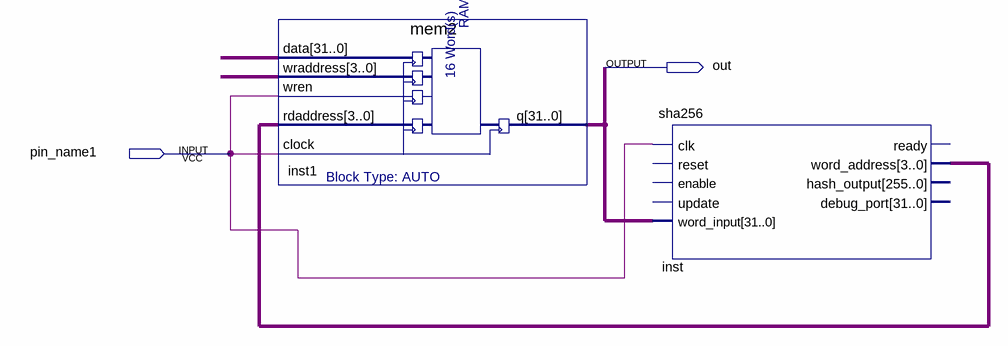
[diagram p0: schematic sheet]
// Quartus schematic Block1.bdf as structural Verilog: 2 symbols, 2 pins
module Block1 (
  input  pin_name1,
  output out
);

  wire [3:0] inst_word_address, undriven_2;
  wire [31:0] inst1_q, undriven;

  mem2 inst1 (
    .data(undriven), .wraddress(undriven_2), .wren(pin_name1), .rdaddress(inst_word_address),
    .clock(pin_name1), .q(inst1_q));
  sha256 inst (
    .clk(pin_name1), .word_input(inst1_q), .word_address(inst_word_address));  // open: reset, enable, update, ready, hash_output, debug_port
endmodule
